# Altium project my_foc.PrjPcb
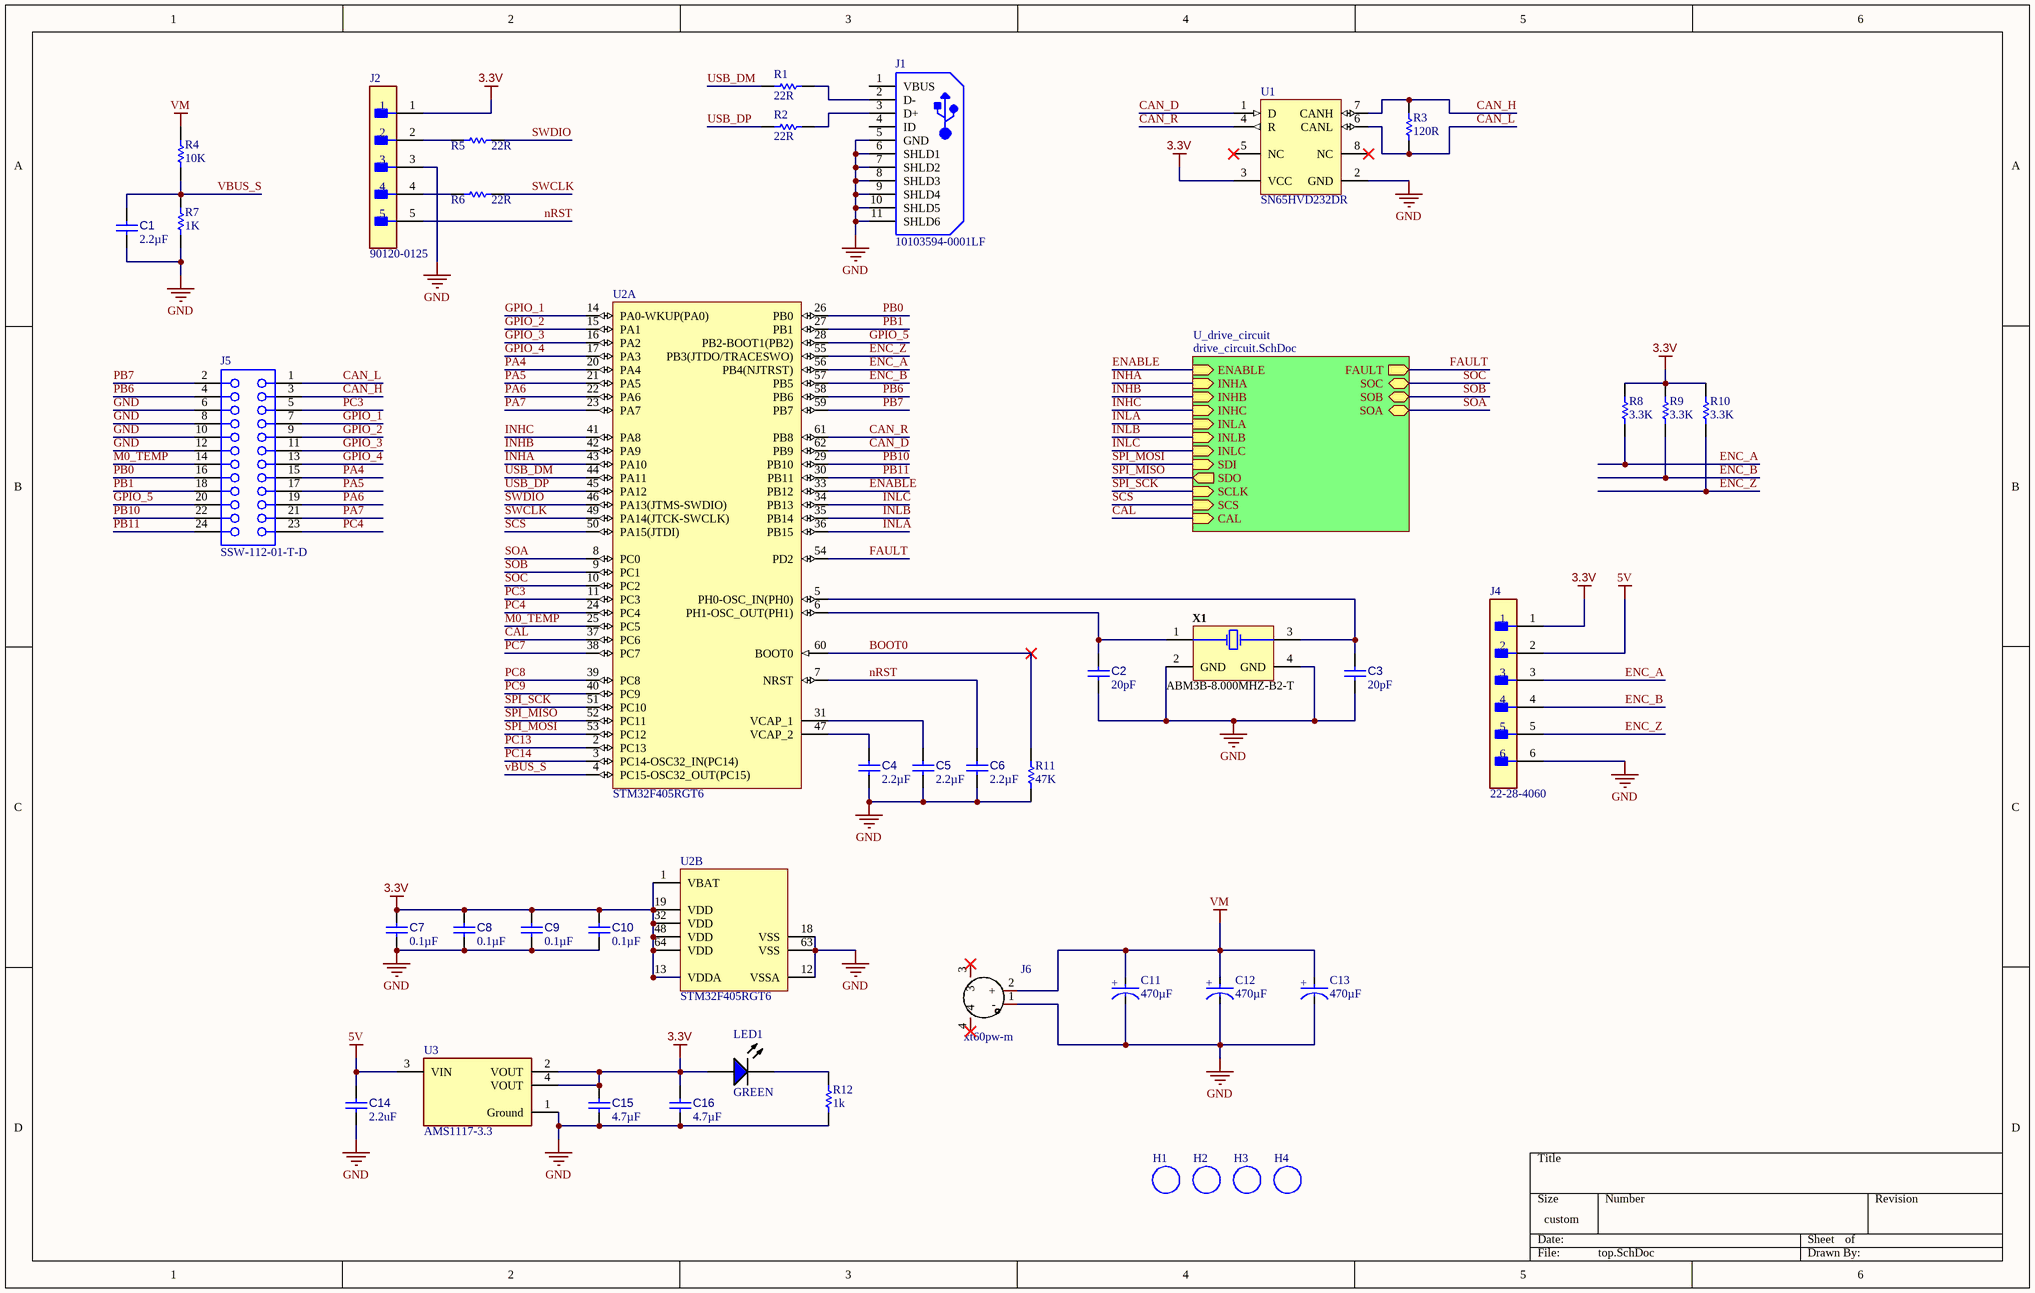
[diagram p0: top.SchDoc]
2 sheets, 96 parts. Net scope: hierarchical (ports join the sheet entries above them; power ports are global).
Board file: BEN_drive.PcbDoc
Sheets:
  top.SchDoc
    U_drive_circuit = drive_circuit.SchDoc

## Sheet top.SchDoc
size 381 x 241 mm; SheetNumber: 1; SheetTotal: 2; SPICEModelCacheGEPUECLQ: <root> / <DocumentId>GEPUECLQ</DocumentId> / </root>

### Parts
C1  value 2.2µF  [CAPC0603(1608)100_L]  (hidden comment: Capacitor 4.7µF +/-20% 10V 0603)
C2  value 20pF  [CAPC0603(1608)100_L]  (hidden comment: Capacitor 4.7µF +/-20% 10V 0603)
C3  value 20pF  [CAPC0603(1608)100_L]  (hidden comment: Capacitor 4.7µF +/-20% 10V 0603)
C4  value 2.2µF  [CAPC0603(1608)100_L]  (hidden comment: Capacitor 4.7µF +/-20% 10V 0603)
C5  value 2.2µF  [CAPC0603(1608)100_L]  (hidden comment: Capacitor 4.7µF +/-20% 10V 0603)
C6  value 2.2µF  [CAPC0603(1608)100_L]  (hidden comment: Capacitor 4.7µF +/-20% 10V 0603)
C7  value 0.1µF  [CAPC0603(1608)100_L]  (hidden comment: Capacitor 4.7µF +/-20% 10V 0603)
C8  value 0.1µF  [CAPC0603(1608)100_L]  (hidden comment: Capacitor 4.7µF +/-20% 10V 0603)
C9  value 0.1µF  [CAPC0603(1608)100_L]  (hidden comment: Capacitor 4.7µF +/-20% 10V 0603)
C10  value 0.1µF  [CAPC0603(1608)100_L]  (hidden comment: Capacitor 4.7µF +/-20% 10V 0603)
C11  value 470µF  [FP-FPG-MFG]  (hidden comment: EEE-FP1E471AP)
C12  value 470µF  [FP-FPG-MFG]  (hidden comment: EEE-FP1E471AP)
C13  value 470µF  [FP-FPG-MFG]  (hidden comment: EEE-FP1E471AP)
C14  value 2.2uF  [CAPC0603(1608)100_L]  (hidden comment: Capacitor 4.7µF +/-20% 10V 0603)
C15  value 4.7µF  [CAPC0603(1608)100_L]  (hidden comment: Capacitor 4.7µF +/-20% 10V 0603)
C16  value 4.7µF  [CAPC0603(1608)100_L]  (hidden comment: Capacitor 4.7µF +/-20% 10V 0603)
H1  (no value)  [M3 Hole]
H2  (no value)  [M3 Hole]
H3  (no value)  [M3 Hole]
H4  (no value)  [M3 Hole]
J1  10103594-0001LF  [FCI-10103594-0001LF_V]
J2  90120-0125  [FP-90120-0125-MFG]
J4  22-28-4060  [FP-22-28-4060-MFG]
J5  SSW-112-01-T-D  [SMTC-SSW-112-01-X-D]
J6  xt60pw-m  [CONN-TH_XT60PW-M]
LED1  GREEN  [VISH-TLMX1100-2_V]
R1  value 22R  [RESC1608X55X25ML10T15]  (hidden comment: Resistor 0R +/- 5% 0603 100 mW)
R2  value 22R  [RESC1608X55X25ML10T15]  (hidden comment: Resistor 0R +/- 5% 0603 100 mW)
R3  value 120R  [RESC1608X55X25ML10T15]  (hidden comment: Resistor 0R +/- 5% 0603 100 mW)
R4  value 10K  [RESC1608X55X25ML10T15]  (hidden comment: Resistor 0R +/- 5% 0603 100 mW)
R5  value 22R  [RESC1608X55X25ML10T15]  (hidden comment: Resistor 0R +/- 5% 0603 100 mW)
R6  value 22R  [RESC1608X55X25ML10T15]  (hidden comment: Resistor 0R +/- 5% 0603 100 mW)
R7  value 1K  [RESC1608X55X25ML10T15]  (hidden comment: Resistor 0R +/- 5% 0603 100 mW)
R8  value 3.3K  [RESC1608X55X25ML10T15]  (hidden comment: Resistor 0R +/- 5% 0603 100 mW)
R9  value 3.3K  [RESC1608X55X25ML10T15]  (hidden comment: Resistor 0R +/- 5% 0603 100 mW)
R10  value 3.3K  [RESC1608X55X25ML10T15]  (hidden comment: Resistor 0R +/- 5% 0603 100 mW)
R11  value 47K  [RESC1608X55X25ML10T15]  (hidden comment: Resistor 0R +/- 5% 0603 100 mW)
R12  value 1k  [RESC1608X55X25ML10T15]  (hidden comment: Resistor 0R +/- 5% 0603 100 mW)
U1  SN65HVD232DR  [D0008A_L]
U2  STM32F405RGT6  [STM-LQFP64_M]  (parts A,B of 2)
U3  AMS1117-3.3  [FP-AMS1117-IPC_B]
X1  ABM3B-8.000MHZ-B2-T  [ABRA-ABM3B_V]

### Sub-sheets
U_drive_circuit = drive_circuit.SchDoc: ENABLE (in), INHA (in), INHB (in), INHC (in), FAULT (out), INLA (in), INLB (in), INLC (in), SDI (in), SDO (out), SCLK (in), SCS (in), CAL (in), SOC (bidir), SOB (bidir), SOA (bidir)

### Nets
3.3V: C7.2 C8.2 C9.2 C10.2 C15.2 C16.2 J2.1 J4.1 LED1.1(A) R8.1 R9.1 R10.1 U1.3(VCC) U2.1(VBAT) U2.13(VDDA) U2.19(VDD) U2.32(VDD) U2.48(VDD) U2.64(VDD) U3.2(VOUT) U3.4(VOUT)
5V: C14.2 J4.2 U3.3(VIN)
GND: C1.1 C2.1 C3.1 C4.1 C5.1 C6.1 C7.1 C8.1 C9.1 C10.1 C11.1(C) C12.1(C) C13.1(C) C14.1 C15.1 C16.1 J1.5(GND) J1.6(SHLD1) J1.7(SHLD2) J1.8(SHLD3) J1.9(SHLD4) J1.10(SHLD5) J1.11(SHLD6) J2.3 J4.6 J5.6 J5.8 J5.10 J5.12 J6.1(-) R7.2 R11.2 R12.1 U1.2(GND) U2.12(VSSA) U2.18(VSS) U2.63(VSS) U3.1(Ground) X1.2(GND) X1.4(GND)
VM: C11.2(A) C12.2(A) C13.2(A) J6.2(+) R4.1
BOOT0: R11.1 U2.60(BOOT0)
CAL: U2.37(PC6) ; sheet U_drive_circuit/CAL
CAN_D: U1.1(D) U2.62(PB9)
CAN_H: J5.3 R3.2 U1.7(CANH)
CAN_L: J5.1 R3.1 U1.6(CANL)
CAN_R: U1.4(R) U2.61(PB8)
ENABLE: U2.33(PB12) ; sheet U_drive_circuit/ENABLE
ENC_A: J4.3 R8.2 U2.56(PB4(NJTRST))
ENC_B: J4.4 R9.2 U2.57(PB5)
ENC_Z: J4.5 R10.2 U2.55(PB3(JTDO/TRACESWO))
FAULT: U2.54(PD2) ; sheet U_drive_circuit/FAULT
GPIO_1: J5.7 U2.14(PA0-WKUP(PA0))
GPIO_2: J5.9 U2.15(PA1)
GPIO_3: J5.11 U2.16(PA2)
GPIO_4: J5.13 U2.17(PA3)
GPIO_5: J5.20 U2.28(PB2-BOOT1(PB2))
INHA: U2.43(PA10) ; sheet U_drive_circuit/INHA
INHB: U2.42(PA9) ; sheet U_drive_circuit/INHB
INHC: U2.41(PA8) ; sheet U_drive_circuit/INHC
INLA: U2.36(PB15) ; sheet U_drive_circuit/INLA
INLB: U2.35(PB14) ; sheet U_drive_circuit/INLB
INLC: U2.34(PB13) ; sheet U_drive_circuit/INLC
M0_TEMP: J5.14 U2.25(PC5)
nRST: C6.2 J2.5 U2.7(NRST)
PA4: J5.15 U2.20(PA4)
PA5: J5.17 U2.21(PA5)
PA6: J5.19 U2.22(PA6)
PA7: J5.21 U2.23(PA7)
PB0: J5.16 U2.26(PB0)
PB1: J5.18 U2.27(PB1)
PB6: J5.4 U2.58(PB6)
PB7: J5.2 U2.59(PB7)
PB10: J5.22 U2.29(PB10)
PB11: J5.24 U2.30(PB11)
PC3: J5.5 U2.11(PC3)
PC4: J5.23 U2.24(PC4)
PC7: U2.38(PC7)
PC8: U2.39(PC8)
PC9: U2.40(PC9)
PC13: U2.2(PC13)
PC14: U2.3(PC14-OSC32_IN(PC14))
SCS: U2.50(PA15(JTDI)) ; sheet U_drive_circuit/SCS
SOA: U2.8(PC0) ; sheet U_drive_circuit/SOA
SOB: U2.9(PC1) ; sheet U_drive_circuit/SOB
SOC: U2.10(PC2) ; sheet U_drive_circuit/SOC
SPI_MISO: U2.52(PC11) ; sheet U_drive_circuit/SDO
SPI_MOSI: U2.53(PC12) ; sheet U_drive_circuit/SDI
SPI_SCK: U2.51(PC10) ; sheet U_drive_circuit/SCLK
SWCLK: R6.1 U2.49(PA14(JTCK-SWCLK))
SWDIO: R5.1 U2.46(PA13(JTMS-SWDIO))
USB_DM: R1.2 U2.44(PA11)
USB_DP: R2.2 U2.45(PA12)
vBUS_S: C1.2 R4.2 R7.1 U2.4(PC15-OSC32_OUT(PC15))
NetC2_2: C2.2 U2.6(PH1-OSC_OUT(PH1)) X1.1(X1)
NetC3_2: C3.2 U2.5(PH0-OSC_IN(PH0)) X1.3(X2)
NetC4_2: C4.2 U2.47(VCAP_2)
NetC5_2: C5.2 U2.31(VCAP_1)
NetJ1_2: J1.2(D-) R1.1
NetJ1_3: J1.3(D+) R2.1
NetJ2_2: J2.2 R5.2
NetJ2_4: J2.4 R6.2
NetLED1_2: LED1.2(K) R12.2

Not connected (* = marked no-connect by the designer): J1 1(VBUS) 4(ID); J6 3* 4*; U1 5(NC)* 8(NC)*

### Notes on the sheet
- (in symbol CMP-001-00087-1) +

### Library data of the parts
C1-C10 C14-C16 = CMP-001-00076-4: Chip Capacitor, 4.7µF +/-20%, 10V, 0603, Thickness 1 mm; Tolerance: 10%; Mounting Technology: SMT; Case/Package: 0603; Pins: 2; Min Operating Temperature: -55°C; Max Operating Temperature: 85°C; Voltage Rating: 10V
C11-C13 = CMP-001-00087-1: Aluminum Electrolytic Capacitor, 470 uF, 25 V, ± 20%, 2000 hours @ 105°C, Radial Can - SMD; Voltage Rating: 25V; Ripple Current (AC): 1.19A; Case/Package: Radial; Tolerance: 20%; Min Operating Temperature: -55°C; Mounting Technology: Surface Mount,PCB; RoHS Compliant: Yes; Pins: 2; Max Operating Temperature: 105°C; Ripple Current: 1.19A
H1-H4 = M3 Hole: M3 Hole with no copper
J1 = CMP-015-00009-1: Conn Micro USB 2.0 Type B RCP 5 POS 0.65mm Solder RA SMD 5 Terminal 1 Port T/R; Mounting Technology: Surface Mount,Horizontal; Pins: 5; Max Operating Temperature: 85°C; Min Operating Temperature: -55°C
J2 = CMP-015-00010-1: 2.54mm Pitch C-Grid III Header, Single Row, Vertical, 5 Circuits, Tin (Sn) Plating; Min Operating Temperature: -55°C; RoHS Compliant: Yes; Max Operating Temperature: 125°C; Mounting Technology: Through Hole
J4 = CMP-015-00011-1: KK 254 Breakaway Header, Vertical, 6 Circuits, Tin (Sn) Plating, Mating Pin Length 6.09mm; Mounting Technology: Through Hole; Max Operating Temperature: 75°C; Min Operating Temperature: 0°C; RoHS Compliant: Yes
J5 = CMP-002-00072-1: Board Connector, 24 Contact(s), 2 Row(s), Female, Straight, 0.1 inch Pitch, Solder Terminal, Locking, Socket; Connector Type: BOARD CONNECTOR; RoHS Compliant: Yes; Mounting Technology: Board
LED1 = CMP-007-00028-2: red LED, 10 mA, 2 V, -40 to 100 degC, 2-Pin SMD (0603), RoHS, Tape and Reel; Manufacturer: Vishay Semiconductor; Forward Voltage: 3.9V; Illumination Colour: Blue; Viewing Angle: 160degrees; Power: 68mW; Forward Current: 10mA; Lens Style: Diffused; Luminous Intensity: 5mcd; Case/Package: 0603; Datasheet URL: http://download.siliconexpert.com/pdfs/2016/8/7/12/43/26/667/vsh_/manual/379263299541529tlmb1100.pdf; Datasheet Version: Rev. 2.7, 03/2016; Manufacturer URL: http://www.vishay.com/; Package Reference: 0603; Min Operating Temperature: -40°C; Packaging: TapeandReel; RoHS Compliant: True; Nominal Vf: 3.9V; Mounting Technology: SM; Pins: 2; Package Description: 2-Pin Surface Mount Device, Body 1.6 x 0.8 mm; Colour: Blue; Package Quantity: 3000; Max Operating Temperature: 100°C
R1 R2 R4-R11 = CMP-009-00006-5: Chip Resistor, 22 Ohm, 0.1 W, -55 to 155 degC, 0603 (1608 Metric); Power: 100mW; Voltage Rating: 50V; Max Operating Temperature: 155°C; RoHS Compliant: True; Mounting Technology: SM; Case/Package: 0603; Min Operating Temperature: -55°C; Tolerance: 5%; Pins: 2
R3 = CMP-009-00006-5: Chip Resistor, 120 Ohm, 0.1 W, -55 to 155 degC, 0603 (1608 Metric); Power: 100mW; Voltage Rating: 50V; Max Operating Temperature: 155°C; RoHS Compliant: True; Mounting Technology: SM; Case/Package: 0603; Min Operating Temperature: -55°C; Tolerance: 5%; Pins: 2
R12 = CMP-009-00006-5: Chip Resistor, 1K Ohm, 0.1 W, -55 to 155 degC, 0603 (1608 Metric); Power: 100mW; Voltage Rating: 50V; Max Operating Temperature: 155°C; RoHS Compliant: True; Mounting Technology: SM; Case/Package: 0603; Min Operating Temperature: -55°C; Tolerance: 5%; Pins: 2
U1 = CMP-015-00008-1: EAR99 65HVD232 Tape & Reel (TR) CANbus interface receiver 100mV 17mA 72.603129mg 1Mbps; Max Supply Voltage: 3.6V; Min Supply Voltage: 3V; Max Operating Temperature: 85°C; Min Operating Temperature: -40°C; Pins: 8; RoHS Compliant: Yes; Case/Package: D
U2 = CMP-020-00025-1: MCU 32-bit STM32F ARM Cortex M4F RISC 1024KB Flash 2.5V/3.3V 64-Pin LQFP Tray; Number of SPI Channels: 3; Number of Channels: 16; Interface: I2C,SPI,USB,CAN,IrDA,UART,USART,LIN,I2S; Oscillator Type: Internal; Watchdog Timer: Yes; Number of Timers/Counters: 14; Number of I/Os: 51; Number of UART Channels: 2; RAM Size: 196KB; Nominal Supply Current: 1.7uA; Data Bus Width: 32b; Max Supply Voltage: 3.6V; Clock Frequency: 168MHz; Min Supply Voltage: 1.8V; Peripherals: Brown-out Detect/Reset,POR,PWM,WDT,DMA,LCD,I2C; Length: 10mm; Memory Size: 1024KB; Lead Free: Lead Free; Height: 1.45mm; Case/Package: LQFP; Min Operating Temperature: -40°C; Series: STM32 F4; Package Quantity: 960; Number of PWM Channels: 2; Max Operating Temperature: 85°C; Core Architecture: ARM; Packaging: Tray; Number of ADC Channels: 16; Pins: 64; Radiation Hardening: No; Number of Programmable I/O: 51; Memory Format: FLASH; Number of USB Channels: 2; Reach SVHC Compliant: No; RoHS Compliant: Yes; Width: 10mm; Number of D/A Converters: 2; Number of A/D Converters: 3; Number of I2C Channels: 3; Frequency: 168MHz
U3 = CMP-019-00049-1: Fixed Positive LDO Regulator, 3.3V, 1.3V Dropout, PDSO3; Pins: 3; RoHS Compliant: Yes; Case/Package: SOP
X1 = CMP-003-00021-2: Ceramic SMD Crystal, 8 MHz, +/- 20 ppm, 18 pF, -20 to 70 degC, 4-Pin SMD, RoHS, Tape and Reel; Manufacturer: Abracon; Resistance: 200Ohm; ESR: 200; Tolerance: 20ppm; Frequency: 8MHz; Load Capacitance: 18pF; Mounting Technology: SM; Case/Package: CSMD; Pins: 4; Datasheet Version: Aug-15; Datasheet URL: http://www.abracon.com/Resonators/abm3b.pdf; Manufacturer URL: http://www.abracon.com/; Package Quantity: 1000; Package Description: 4-Pin Surface Mount Device, Body 5 x 3.2 mm; Package Reference: ABM3B; Min Operating Temperature: -20°C; Max Operating Temperature: 70°C; Packaging: TapeandReel; Frequency Tolerance: 20ppm; RoHS Compliant: True

## Sheet drive_circuit.SchDoc
size 449 x 299 mm; SheetNumber: 2; SheetTotal: 2
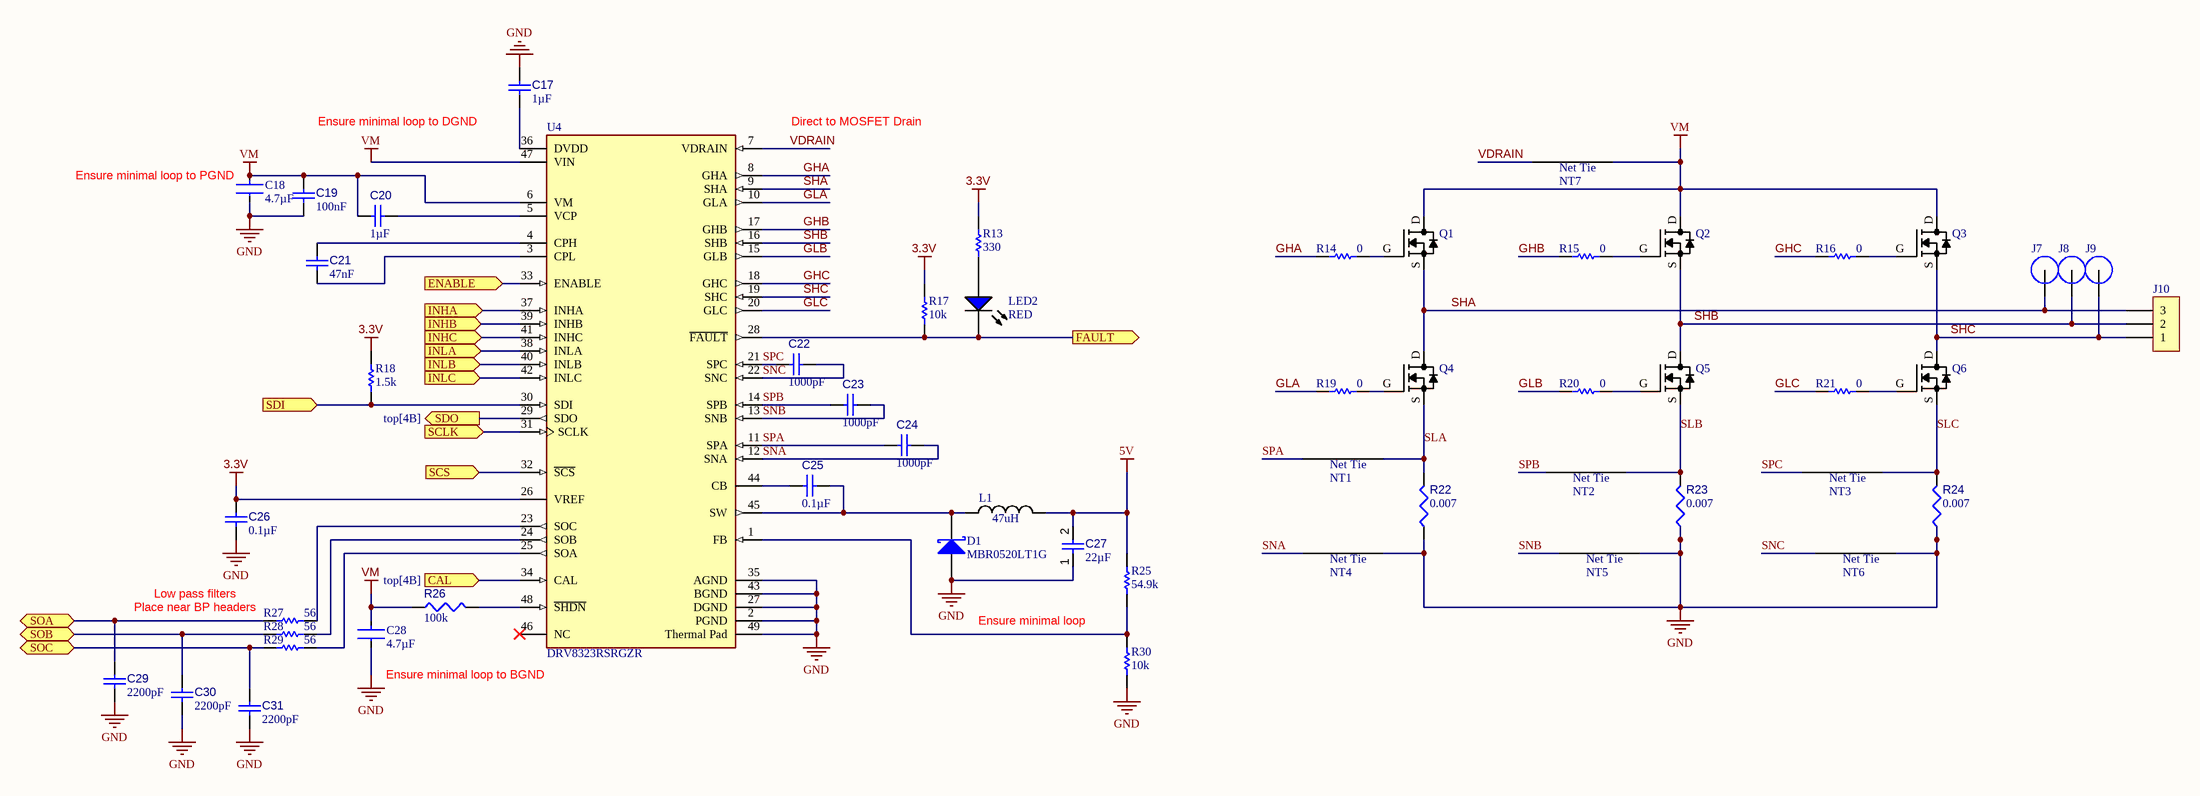
[diagram p1: drive_circuit.SchDoc]

### Parts
C17  value 1µF  [CAPC1608X94X35NL15T15]  (hidden comment: Capacitor 1 uF +/- 10% 16 V 0603)
C18  value 4.7µF  [FP-MK325N-MFG]  (hidden comment: HMK325B7225KN-T)
C19  value 100nF  [CAPC0603(1608)100_L]  (hidden comment: Capacitor 4.7µF +/-20% 10V 0603)
C20  value 1µF  [CAPC1608X94X35NL15T15]  (hidden comment: Capacitor 1 uF +/- 10% 16 V 0603)
C21  value 47nF  [CAPC0603(1608)100_L]  (hidden comment: Capacitor 4.7µF +/-20% 10V 0603)
C22  value 1000pF  [CAPC1608X94X35NL15T15]  (hidden comment: Capacitor 1 uF +/- 10% 16 V 0603)
C23  value 1000pF  [CAPC1608X94X35NL15T15]  (hidden comment: Capacitor 1 uF +/- 10% 16 V 0603)
C24  value 1000pF  [CAPC1608X94X35NL15T15]  (hidden comment: Capacitor 1 uF +/- 10% 16 V 0603)
C25  value 0.1µF  [CAPC1608X94X35NL15T15]  (hidden comment: Capacitor 1 uF +/- 10% 16 V 0603)
C26  value 0.1µF  [CAPC1608X94X35NL15T15]  (hidden comment: Capacitor 1 uF +/- 10% 16 V 0603)
C27  value 22µF  [CAPC3216X180X50NL20T25]  (hidden comment: Capacitor 10 uF +/- 10% 16 V 1206)
C28  value 4.7µF  [FP-MK325N-MFG]  (hidden comment: HMK325B7225KN-T)
C29  value 2200pF  [CAPC1608X94X35NL15T15]  (hidden comment: Capacitor 1 uF +/- 10% 16 V 0603)
C30  value 2200pF  [CAPC1608X94X35NL15T15]  (hidden comment: Capacitor 1 uF +/- 10% 16 V 0603)
C31  value 2200pF  [CAPC1608X94X35NL15T15]  (hidden comment: Capacitor 1 uF +/- 10% 16 V 0603)
D1  MBR0520LT1G  [ONSC-SOD-123-2-425-04_V]
J7  (no value)  [M3 Spade Hole]
J8  (no value)  [M3 Spade Hole]
J9  (no value)  [M3 Spade Hole]
J10  1704936  [1704936]  (value not drawn)
L1  value 47uH  [INDC6060X28N]  (hidden comment: 22uH)
LED2  RED  [VISH-TLMX1100-2_V]
NT1  0.25mm  [NetTie_0.25mm]  (value not drawn)  (net tie, no BOM)
NT2  0.25mm  [NetTie_0.25mm]  (value not drawn)  (net tie, no BOM)
NT3  0.25mm  [NetTie_0.25mm]  (value not drawn)  (net tie, no BOM)
NT4  0.25mm  [NetTie_0.25mm]  (value not drawn)  (net tie, no BOM)
NT5  0.25mm  [NetTie_0.25mm]  (value not drawn)  (net tie, no BOM)
NT6  0.25mm  [NetTie_0.25mm]  (value not drawn)  (net tie, no BOM)
NT7  0.25mm  [NetTie_0.25mm]  (value not drawn)  (net tie, no BOM)
Q1  (no value)  [SO8FL]
Q2  (no value)  [SO8FL]
Q3  (no value)  [SO8FL]
Q4  (no value)  [SO8FL]
Q5  (no value)  [SO8FL]
Q6  (no value)  [SO8FL]
R13  value 330  [RESC1608X55X25ML10T15]  (hidden comment: Resistor 0R +/- 5% 0603 100 mW)
R14  value 0  [RESC1608X55X25ML10T15]  (hidden comment: Resistor 0R +/- 5% 0603 100 mW)
R15  value 0  [RESC1608X55X25ML10T15]  (hidden comment: Resistor 0R +/- 5% 0603 100 mW)
R16  value 0  [RESC1608X55X25ML10T15]  (hidden comment: Resistor 0R +/- 5% 0603 100 mW)
R17  value 10k  [RESC1608X55X25ML10T15]  (hidden comment: Resistor 0R +/- 5% 0603 100 mW)
R18  value 1.5k  [RESC1608X55X25ML10T15]  (hidden comment: Resistor 0R +/- 5% 0603 100 mW)
R19  value 0  [RESC1608X55X25ML10T15]  (hidden comment: Resistor 0R +/- 5% 0603 100 mW)
R20  value 0  [RESC1608X55X25ML10T15]  (hidden comment: Resistor 0R +/- 5% 0603 100 mW)
R21  value 0  [RESC1608X55X25ML10T15]  (hidden comment: Resistor 0R +/- 5% 0603 100 mW)
R22  value 0.007  [FP-RT2512-MFG]  (hidden comment: RT2512BKD071K21L)
R23  value 0.007  [FP-RT2512-MFG]  (hidden comment: RT2512BKD071K21L)
R24  value 0.007  [FP-RT2512-MFG]  (hidden comment: RT2512BKD071K21L)
R25  value 54.9k  [RESC1608X55X25ML10T15]  (hidden comment: Resistor 0R +/- 5% 0603 100 mW)
R26  value 100k  [RESC1608X55X25ML10T15]  (hidden comment: Resistor 100k +/-1% 0603 100 mW)
R27  value 56  [RESC1608X55X25ML10T15]  (hidden comment: Resistor 0R +/- 5% 0603 100 mW)
R28  value 56  [RESC1608X55X25ML10T15]  (hidden comment: Resistor 0R +/- 5% 0603 100 mW)
R29  value 56  [RESC1608X55X25ML10T15]  (hidden comment: Resistor 0R +/- 5% 0603 100 mW)
R30  value 10k  [RESC1608X55X25ML10T15]  (hidden comment: Resistor 0R +/- 5% 0603 100 mW)
U4  DRV8323RSRGZR  [FP-RGZ0048A-IPC_A]

### Ports
CAL (in, see top[4B]), ENABLE (in, see top[4B]), FAULT (out, see top[5B]), INHA (in, see top[4B]), INHB (in, see top[4B]), INHC (in, see top[4B]), INLA (in, see top[4B]), INLB (in, see top[4B]), INLC (in, see top[4B]), SCLK (in, see top[4B]), SCS (in, see top[4B]), SDI (in, see top[4B]), SDO (out, see top[4B]), SOA (bidir, see top[5B]), SOB (bidir, see top[5B]), SOC (bidir, see top[5B])

### Nets
3.3V: C26.2 R13.2 R17.2 R18.2 U4.26(VREF)
5V: C27.2 L1.2 R25.2
GND: C17.2 C18.2 C19.1 C26.1 C27.1 C28.2 C29.1 C30.1 C31.1 D1.1(A) NT4.2 NT5.2 NT6.2 R22.1 R23.1 R24.1 R30.1 U4.2(PGND) U4.27(DGND) U4.35(AGND) U4.43(BGND) U4.49(Thermal_Pad)
VM: C18.1 C19.2 C20.1 C28.1 NT7.2 Q1.D Q2.D Q3.D R26.1 U4.6(VM) U4.47(VIN)
CAL: U4.34(CAL) ; port CAL
ENABLE: U4.33(ENABLE) ; port ENABLE
FAULT: LED2.2(K) R17.1 U4.28(~{FAULT}) ; port FAULT
GHA: R14.2 U4.8(GHA)
GHB: R15.2 U4.17(GHB)
GHC: R16.2 U4.18(GHC)
GLA: R19.2 U4.10(GLA)
GLB: R20.2 U4.15(GLB)
GLC: R21.2 U4.20(GLC)
INHA: U4.37(INHA) ; port INHA
INHB: U4.39(INHB) ; port INHB
INHC: U4.41(INHC) ; port INHC
INLA: U4.38(INLA) ; port INLA
INLB: U4.40(INLB) ; port INLB
INLC: U4.42(INLC) ; port INLC
SCS: U4.32(~{SCS}) ; port SCS
SHA: J7.1 J10.3 Q1.S Q4.D U4.9(SHA)
SHB: J8.1 J10.2 Q2.S Q5.D U4.16(SHB)
SHC: J9.1 J10.1 Q3.S Q6.D U4.19(SHC)
SLA: NT1.2 Q4.S R22.2
SLB: NT2.2 Q5.S R23.2
SLC: NT3.2 Q6.S R24.2
SNA: C24.1 NT4.1 U4.12(SNA)
SNB: C23.1 NT5.1 U4.13(SNB)
SNC: C22.1 NT6.1 U4.22(SNC)
SOA: C29.2 R27.2 ; port SOA
SOB: C30.2 R28.2 ; port SOB
SOC: C31.2 R29.2 ; port SOC
SPA: C24.2 NT1.1 U4.11(SPA)
SPB: C23.2 NT2.1 U4.14(SPB)
SPC: C22.2 NT3.1 U4.21(SPC)
SPI_MISO: U4.29(SDO) ; port SDO
SPI_MOSI: R18.1 U4.30(SDI) ; port SDI
SPI_SCK: U4.31(SCLK) ; port SCLK
VDRAIN: NT7.1 U4.7(VDRAIN)
NetC17_1: C17.1 U4.36(DVDD)
NetC20_2: C20.2 U4.5(VCP)
NetC21_1: C21.1 U4.4(CPH)
NetC21_2: C21.2 U4.3(CPL)
NetC25_1: C25.1 D1.2(K) L1.1 U4.45(SW)
NetC25_2: C25.2 U4.44(CB)
NetLED2_1: LED2.1(A) R13.1
NetQ1_G: Q1.G R14.1
NetQ2_G: Q2.G R15.1
NetQ3_G: Q3.G R16.1
NetQ4_G: Q4.G R19.1
NetQ5_G: Q5.G R20.1
NetQ6_G: Q6.G R21.1
NetR25_1: R25.1 R30.2 U4.1(FB)
NetR26_2: R26.2 U4.48(~{SHDN})
NetR27_1: R27.1 U4.23(SOC)
NetR28_1: R28.1 U4.24(SOB)
NetR29_1: R29.1 U4.25(SOA)

Not connected (* = marked no-connect by the designer): U4 46(NC)*

### Notes on the sheet
- Ensure minimal loop to DGND
- Direct to MOSFET Drain
- (near C18) Ensure minimal loop to PGND
- Low pass filters
- Place near BP headers
- Ensure minimal loop
- Ensure minimal loop to BGND
- (in symbol NetTie_0.25mm) Net Tie

### Library data of the parts
C17 = CMP-001-00003-6: Chip Capacitor, 1 uF, +/- 10%, 6.3 V, 0603 (1608 Metric); Voltage Rating: 16V; Capacitor Type: Ceramic; Max Operating Temperature: 125°C; Pins: 2; Tolerance: 10%; Min Operating Temperature: -55°C; RoHS Compliant: True; Mounting Technology: SM; Case/Package: 0603
C18 C28 = CMP-001-00088-1: Ceramic Capacitor, Multilayer, Ceramic, 100V, 10% +Tol, 10% -Tol, X7R, 15% TC, 2.2uF, Surface Mount, 1210; Capacitor Type: Ceramic; Min Operating Temperature: -55°C; Pins: 2; Case/Package: 1210; Mounting Technology: Surface Mount; Max Operating Temperature: 125°C; RoHS Compliant: Yes
C19 = CMP-001-00076-4: Chip Capacitor, 4.7µF +/-20%, 100V, 0603, Thickness 1 mm; Tolerance: 10%; Mounting Technology: SMT; Case/Package: 0603; Pins: 2; Min Operating Temperature: -55°C; Max Operating Temperature: 85°C; Voltage Rating: 10V
C20 = CMP-001-00003-6: Chip Capacitor, 1 uF, +/- 10%, 16 V, 0603 (1608 Metric); Voltage Rating: 16V; Capacitor Type: Ceramic; Max Operating Temperature: 125°C; Pins: 2; Tolerance: 10%; Min Operating Temperature: -55°C; RoHS Compliant: True; Mounting Technology: SM; Case/Package: 0603
C21 = CMP-001-00076-4: Chip Capacitor, 47nF +/-20%, 100V, 0603, Thickness 1 mm; Tolerance: 10%; Mounting Technology: SMT; Case/Package: 0603; Pins: 2; Min Operating Temperature: -55°C; Max Operating Temperature: 85°C; Voltage Rating: 10V
C22-C26 C29-C31 = CMP-001-00003-6: Chip Capacitor, 0.1uF, +/- 10%, 6.3 V, 0603 (1608 Metric); Voltage Rating: 16V; Capacitor Type: Ceramic; Max Operating Temperature: 125°C; Pins: 2; Tolerance: 10%; Min Operating Temperature: -55°C; RoHS Compliant: True; Mounting Technology: SM; Case/Package: 0603
C27 = CMP-001-00016-6: Chip Capacitor, 22 uF, +/- 10%, 16 V, 1206 (3216 Metric); Capacitor Type: Ceramic; Voltage Rating: 16V; Tolerance: 10%; Min Operating Temperature: -55°C; Pins: 2; Mounting Technology: SM; Case/Package: 1206; Max Operating Temperature: 125°C; RoHS Compliant: True
D1 = CMP-004-00003-2: Schottky Power Rectifier, 20 V, 5.5 A, -65 to 125 degC, 2-Pin SMD, RoHS, Tape and Reel; Manufacturer: ON Semiconductor; Forward Current: 500mA; Peak Reverse Current: 250uA; Elements: 1; Forward Voltage: 385mV; Max Surge Current: 5.5A; Max Operating Temperature: 125°C; Min Operating Temperature: -65°C; Mounting Technology: SM; Datasheet URL: http://www.onsemi.cn/pub_link/Collateral/MBR0520LT1-D.PDF; RoHS Compliant: True; Pins: 2; Package Quantity: 3000; Case/Package: SOD; Package Reference: SOD-123-2-425-04; Package Description: 2-Pin Surface Mount Device, Body 2.69 x 1.6 mm; Packaging: TapeandReel; Manufacturer URL: http://www.onsemi.com/; Datasheet Version: Rev. 6, 01/2012
J7-J9 = M3 Spade Terminal
J10 = 1704936: CONN TERM BLOCK 3POS 7.62MM; Manufacturer: Phoenix Contact; Number of Levels: 1; Positions Per Level: 3; Pitch: 0.300" (7.62mm); Mating Orientation: Horizontal with Board; Current: 30A; Voltage: 300V; Wire Gauge: 10-30 AWG; Wire Termination: Screw - Rising Cage Clamp; Torque - Screw: 0.5-0.6 Nm (4.4-5.3 Lb-In); Screw Thread: M3; Supplier 1: Digi-Key; Supplier Part Number 1: 277-5954-ND; RoHS: RoHS Compliant; Category: Connectors, Interconnects; Stock: 3559; Pricing 1: 1=2.19, 10=2.128, 50=1.989, 100=1.8299, 250=1.69064, 500=1.61108, 1000=1.482 (USD); Packaging: Bulk; Part Status: Active; Mounting Type: Through Hole; Features: Interlocking (Side); Color: Green; Operating Temperature: -; Housing Material: Polyamide (PA), Nylon; Contact Material - Plating: -; Clamp Material - Plating: -; Screw Material - Plating: -; ComponentLink1URL: http://media.digikey.com/PDF/Data%20Sheets/Phoenix%20Contact%20PDFs/1704936.pdf; ComponentLink1Description: http://media.digikey.com/PDF/Data%20Sheets/Phoenix%20Contact%20PDFs/1704936.pdf; Manufacturer Part Number: 1704936
L1 = NR6028T220M: INDUCTOR 47UH 1.4A 175.5 MOHM
LED2 = CMP-007-00028-2: as LED1 on sheet top; Case/Package: 0603; Datasheet URL: http://download.siliconexpert.com/pdfs/2016/8/7/12/43/26/667/vsh_/manual/379263299541529tlmb1100.pdf; Datasheet Version: Rev. 2.7, 03/2016; Manufacturer URL: http://www.vishay.com/; Package Reference: 0603; Min Operating Temperature: -40°C; Packaging: TapeandReel; RoHS Compliant: True; Nominal Vf: 3.9V; Mounting Technology: SM; Pins: 2; Package Description: 2-Pin Surface Mount Device, Body 1.6 x 0.8 mm; Colour: Blue; Package Quantity: 3000; Max Operating Temperature: 100°C
NT1-NT7 = NetTie_0.25mm
Q1-Q6 = NTMFS4935NT1G: MOSFET N-CH 30V 13A SO8FL; Manufacturer: ON Semiconductor; FET Type: N-Channel; Current - Continuous Drain (Id) @ 25°C: 13A (Ta), 93A (Tc); Drive Voltage (Max Rds On,  Min Rds On): 4.5V, 10V; Vgs(th) (Max) @ Id: 2.2V @ 250µA; Gate Charge (Qg) (Max) @ Vgs: 49.4nC @ 10V; Input Capacitance (Ciss) (Max) @ Vds: 4850pF @ 15V; Vgs (Max): ±20V; Power Dissipation (Max): 930mW (Ta), 48W (Tc); Rds On (Max) @ Id, Vgs: 3.2 mOhm @ 30A, 10V; Supplier 1: Digi-Key; Supplier Part Number 1: NTMFS4935NT1GOSCT-ND; RoHS: RoHS Compliant; Category: Discrete Semiconductor Products; Stock 1: 932; Pricing 1: 1=0.61, 10=0.541, 100=0.4145, 500=0.3277 (USD); Packaging: Cut Tape (CT); Part Status: Active; Technology: MOSFET (Metal Oxide); Drain to Source Voltage (Vdss): 30V; FET Feature: -; Operating Temperature: -55°C ~ 150°C (TJ); Mounting Type: Surface Mount; Supplier Device Package: 5-DFN (5x6) (8-SOFL); Package / Case: 8-PowerTDFN, 5 Leads; ComponentLink1URL: http://www.onsemi.com/pub_link/Collateral/NTMFS4935N-D.PDF; ComponentLink1Description: http://www.onsemi.com/pub_link/Collateral/NTMFS4935N-D.PDF; Manufacturer Part Number: NTMFS4935NT1G
R13 = CMP-009-00006-5: Chip Resistor, 330 Ohm, 0.1 W, -55 to 155 degC, 0603 (1608 Metric); Power: 100mW; Voltage Rating: 50V; Max Operating Temperature: 155°C; RoHS Compliant: True; Mounting Technology: SM; Case/Package: 0603; Min Operating Temperature: -55°C; Tolerance: 5%; Pins: 2
R14-R17 R19-R21 R25 R27-R30 = CMP-009-00006-5: Chip Resistor, 10k Ohm, 0.1 W, -55 to 155 degC, 0603 (1608 Metric); Power: 100mW; Voltage Rating: 50V; Max Operating Temperature: 155°C; RoHS Compliant: True; Mounting Technology: SM; Case/Package: 0603; Min Operating Temperature: -55°C; Tolerance: 5%; Pins: 2
R18 = CMP-009-00006-5: Chip Resistor, 1.5k Ohm, 0.1 W, -55 to 155 degC, 0603 (1608 Metric); Power: 100mW; Voltage Rating: 50V; Max Operating Temperature: 155°C; RoHS Compliant: True; Mounting Technology: SM; Case/Package: 0603; Min Operating Temperature: -55°C; Tolerance: 5%; Pins: 2
R22-R24 = CMP-009-00179-1: Fixed Resistor, Thin Film, 0.75W, 1210ohm, 200V, 0.1% +/-Tol, 25ppm/Cel, Surface Mount, 2512; Power: 750mW; Case/Package: 2512; RoHS Compliant: Yes; Mounting Technology: Surface Mount; Max Operating Temperature: 125°C; Pins: 2; Tolerance: 0.1%; Min Operating Temperature: -55°C
R26 = CMP-009-00023-5: Chip Resistor, 100 KOhm, +/- 1%, 0.1 W, -55 to 155 degC, 0603 (1608 Metric); Voltage Rating: 50V; Power: 100mW; Max Operating Temperature: 155°C; RoHS Compliant: True; Tolerance: 1%; Pins: 2; Case/Package: 0603; Mounting Technology: SM; Min Operating Temperature: -55°C
U4 = CMP-00024-00006-1: Brushless DC Motor Controller, 0.005A, PQCC48; RoHS Compliant: Yes

## Nets that join several sheets
3.3V: top (21 pins), drive_circuit (5 pins)
5V: top (C14.2 J4.2 U3.3), drive_circuit (C27.2 L1.2 R25.2)
GND: top (40 pins), drive_circuit (22 pins)
VM: top (5 pins), drive_circuit (11 pins)
CAL: top (U2.37), drive_circuit (U4.34)
ENABLE: top (U2.33), drive_circuit (U4.33)
FAULT: top (U2.54), drive_circuit (LED2.2 R17.1 U4.28)
INHA: top (U2.43), drive_circuit (U4.37)
INHB: top (U2.42), drive_circuit (U4.39)
INHC: top (U2.41), drive_circuit (U4.41)
INLA: top (U2.36), drive_circuit (U4.38)
INLB: top (U2.35), drive_circuit (U4.40)
INLC: top (U2.34), drive_circuit (U4.42)
SCS: top (U2.50), drive_circuit (U4.32)
SOA: top (U2.8), drive_circuit (C29.2 R27.2)
SOB: top (U2.9), drive_circuit (C30.2 R28.2)
SOC: top (U2.10), drive_circuit (C31.2 R29.2)
SPI_MISO: top (U2.52), drive_circuit (U4.29)
SPI_MOSI: top (U2.53), drive_circuit (R18.1 U4.30)
SPI_SCK: top (U2.51), drive_circuit (U4.31)